# Altium schematic sheet Sheet1.SchDoc
size A4; Author: Christian Kieser; Engineer: Christian Kieser
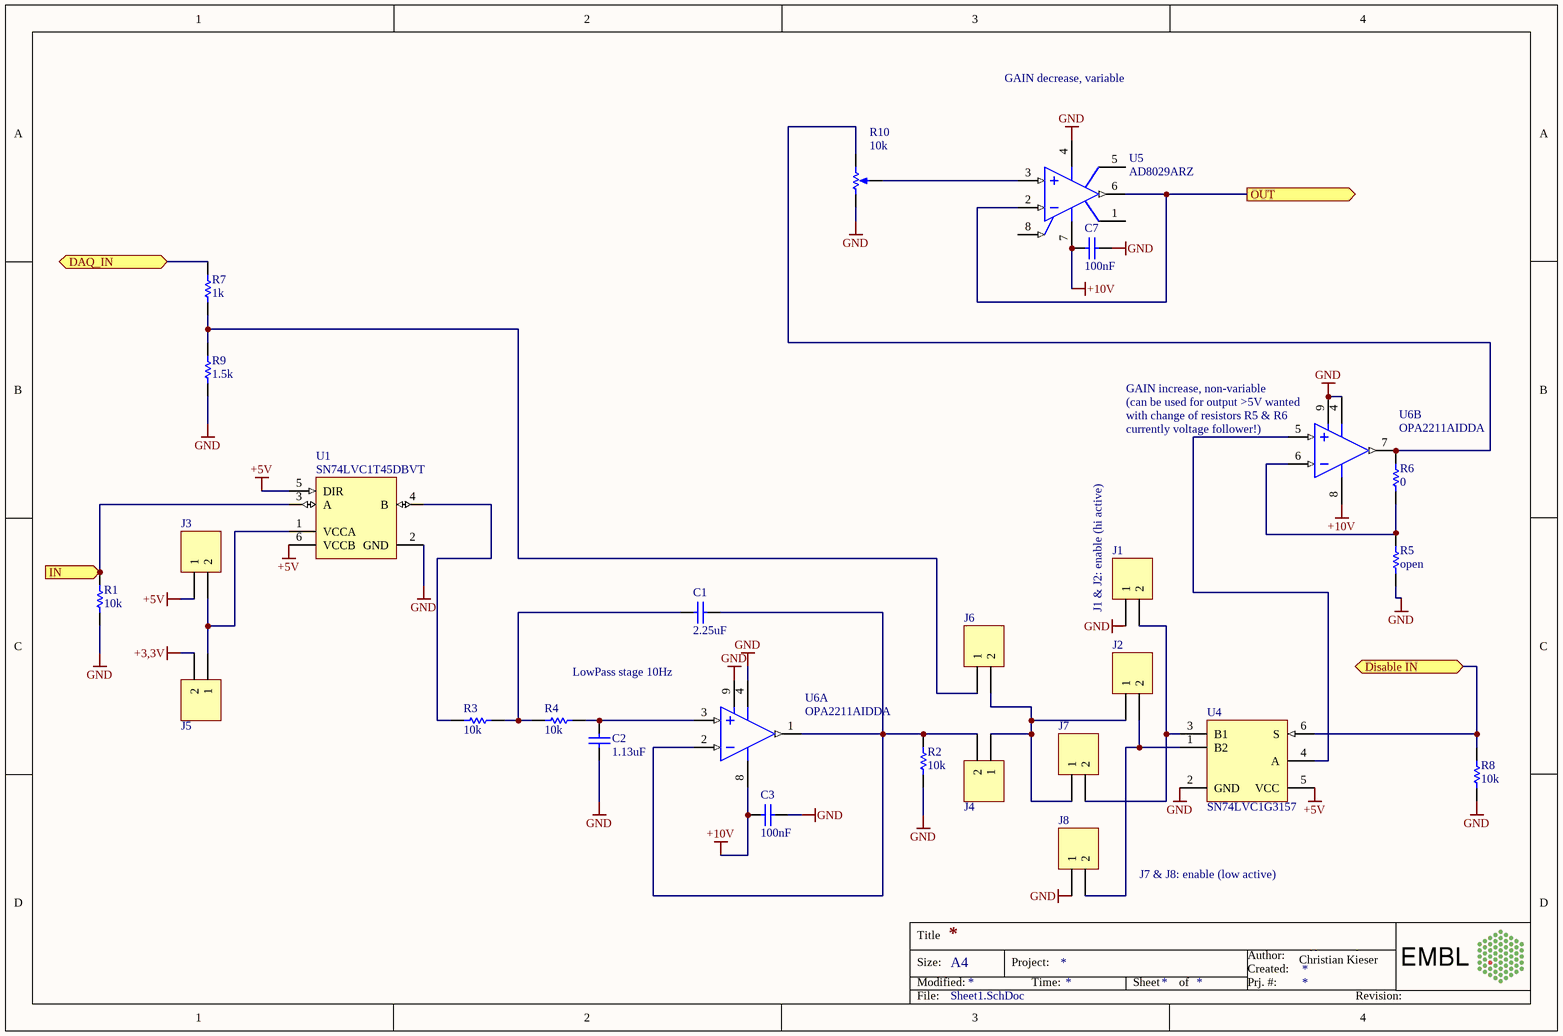
[diagram p0: Sheet1.SchDoc]

## Parts
C1  2.25uF  [CAPC1206(3216)190_N]
C2  1.13uF  [CAPC1206(3216)190_N]
C3  100nF  [CAPC2013X88X50ML20T25]
C7  100nF  [CAPC2013X88X50ML20T25]
J1  61300211121  [61300211121]  (value not drawn)
J2  61300211121  [61300211121]  (value not drawn)
J3  61300211121  [61300211121]  (value not drawn)
J4  61300211121  [61300211121]  (value not drawn)
J5  61300211121  [61300211121]  (value not drawn)
J6  61300211121  [61300211121]  (value not drawn)
J7  61300211121  [61300211121]  (value not drawn)
J8  61300211121  [61300211121]  (value not drawn)
R1  10k  [YAGO-RC0805_M]
R2  10k  [YAGO-RC0805_M]
R3  10k  [YAGO-RC0805_M]
R4  10k  [YAGO-RC0805_M]
R5  open  [YAGO-RC0805_M]
R6  0  [YAGO-RC0805_M]
R7  1k  [YAGO-RC0805_M]
R8  10k  [YAGO-RC0805_M]
R9  1.5k  [YAGO-RC0805_M]
R10  10k  [Typ 3362P]
U1  SN74LVC1T45DBVT  [DBV0006A_M]
U4  SN74LVC1G3157  [DBV0006A_N]
U5  AD8029ARZ  [ADI-R-8_L]
U6  OPA2211AIDDA  [DDA0008C_M]  (parts A,B of 2)

## Ports
DAQ_IN, Disable IN, IN (in), OUT (out)

## Nets
+3,3V: J5.2
+5V: J3.1 U1.5(DIR) U1.6(VCCB) U4.5(VCC)
+10V: C3.2 C7.2 U5.7(+VS) U6.8(V+)
GND: C2.1 C3.1 C7.1 J1.1 J8.1 R1.1 R2.1 R5.1 R8.2 R9.1 R10.1(CCW) U1.2(GND) U4.2(GND) U5.4(-VS) U6.4(V-) U6.9(EP)
DAQ_IN: R7.2 ; port DAQ_IN
Disable IN: R8.1 U4.6(S) ; port Disable IN
IN: R1.2 U1.3(A) ; port IN
OUT: U5.2(-IN) U5.6(VOUT) ; port OUT
NetC1_1: C1.1 R3.1 R4.2
NetC1_2: C1.2 J4.2 R2.2 U6.1(OUT_A) U6.2(IN_A-)
NetC2_2: C2.2 R4.1 U6.3(IN_A+)
NetJ1_2: J1.2 J7.2 U4.3(B1)
NetJ2_1: J2.1 J4.1 J6.2 J7.1
NetJ2_2: J2.2 J8.2 U4.1(B2)
NetJ3_2: J3.2 J5.1 U1.1(VCCA)
NetJ6_1: J6.1 R7.1 R9.2
NetR3_2: R3.2 U1.4(B)
NetR5_2: R5.2 R6.1 U6.6(IN_B-)
NetR6_2: R6.2 R10.3(CW) U6.7(OUT_B)
NetR10_2: R10.2(S) U5.3(+IN)
NetU4_4: U4.4(A) U6.5(IN_B+)

Not connected (* = marked no-connect by the designer): U5 1(NC) 5(NC) 8(~{DISABLE})

## Notes on the sheet
- GAIN decrease, variable
- (near U6) GAIN increase, non-variable
- (near U6) with change of resistors R5 & R6
- (near U6) (can be used for output >5V wanted
- (near U6) currently voltage follower!)
- (near J1) J1 & J2: enable (hi active)
- LowPass stage 10Hz
- J7 & J8: enable (low active)
- Christian Kieser
- Title
- Size:
- Modified:
- A4
- Project:
- Time:
- Sheet
- of
- Created:
- Author:
- Prj. #:
- Alfons Riedinger
- File:
- Revision:

## Library data of the parts
C1 C2 = CMP-001-0138-A.1: CAP CER 1UF 10V X7R 1206; Manufacturer: Wurth Electronics Inc.; Manufacturer Part Number: 885012208013; Notification: Current market demand for these product types have resulted in fluctuating and extending lead times. Lead times may differ.; Tolerance: ±10%; Applications: General Purpose; ComponentLink1Description: 885012208013.pdf; ComponentLink1URL: http://katalog.we-online.de/pbs/datasheet/885012208013.pdf; Features: -; Height - Seated (Max): -; Lead Spacing: -; Lead Style: -; Mounting Type: Surface Mount, MLCC; Operating Temperature: -55°C ~ 125°C; Package / Case: 1206 (3216 Metric); Packaging: Cut Tape (CT); Part Status: Active; Ratings: -; Size / Dimension: 0.126" L x 0.063" W (3.20mm x 1.60mm); Supplier: Digi-Key; Supplier Part Number: 732-7685-1-ND; Temperature Coefficient: X7R; Thickness (Max): 0.051" (1.30mm); Voltage - Rated: 10V
C3 C7 = CMP-001-0082-2: generic 0805 COG oder X7R Vielschichtkondensatoren max. +/-10%
J1-J8 = CMP-001-0071-1: 2Pol; gerade; WR-PHD 2.54 mm THT Pin Header; Brand: Wurth Electronics; Current Rating: 3 A; Insulation Resistance: 1 GOhms; Latching Type: Unlatched; Mating Post Length: 6 mm; Mounting Angle: Straight; Number of Positions: 2 Position; Pitch: 2.54 mm; Voltage Rating: 250 V; Accessory Type: -; Application: Wire to Board; ComponentLink1Description: 6130xx11121-538006.pdf; ComponentLink1URL: http://www.mouser.com/ds/2/445/6130xx11121-538006.pdf; Contact Gender: Pin (Male); Contact Material: Copper Alloy; Contact Plating: Gold; Contact Type: -; Flammability Rating: UL 94 V-0; Housing Gender: -; Housing Material: Polybutylene Terephthalate (PBT); Manufacturer: Wurth Electronics; Manufacturer Part Number: 61300211121; Minimum Order Quantity: 1; Mounting Style: Straight Pin; Number of Rows: 1 Row; Packaging: Bulk; Product: Headers; Reeling: False; RoHS - Mouser: Y; Row Spacing: -; Series: WR-PHD; Standard Pack Qty: 1000; Supplier: Mouser; Supplier Part Number: 710-61300211121; Termination Post Length: 3 mm; Termination Style: Through Hole; Type: Pin Strip; PartNumber: 61300211121
R1-R9 = CMP-001-0027-2: 0805 Yageo Standard BlackBox Resistors; Power (Watts): 0.125W, 1/8W; Temperature Coefficient: ±200ppm/°C; Tolerance: ±1%; ComponentLink1Description: PYu-RC_Group_51_RoHS_L_7.pdf; Part Status: Active; Size / Dimension: 0.079" L x 0.049" W (2.00mm x 1.25mm); Supplier Device Package: 0805; ComponentLink1URL: http://www.yageo.com/documents/recent/PYu-RC_Group_51_RoHS_L_7.pdf; Composition: Thick Film; Failure Rate: -; Features: Moisture Resistant; Height - Seated (Max): 0.024" (0.60mm); Manufacturer: Yageo; Operating Temperature: -55°C ~ 155°C; Package / Case: 0805 (2012 Metric); Packaging: Digi-Reel®
R10 = CMP-001-0077-3: Trimmer_stehend_quadratisch_Verstellung-von-oben; Manufacturer: Bourns Inc.; Manufacturer Part Number: 3362P-1-103LF; Adjustment Type: Top Adjustment; Number of Turns: 1; Power (Watts): 0.5W, 1/2W; Resistive Material: Cermet; Temperature Coefficient: ±100ppm/°C; Tolerance: ±10%; ComponentLink1Description: 3362.pdf; ComponentLink1URL: http://www.bourns.com/docs/Product-Datasheets/3362.pdf; Mounting Type: Through Hole; Packaging: Tube; Part Status: Active; Resistance (Ohms): 10k; Size / Dimension: Rectangular - 0.275" x 0.260" Face x 0.185" H (6.99mm x 6.60mm x 4.70mm); Supplier: Digi-Key; Supplier Part Number: 3362P-103LF-ND; Termination Style: PC Pins; PartNumber: 3362P-1-103LF
U1 = CMP-00492-1: Single-Bit Dual-Supply Bus Transceiver with Configurable Voltage Translation and 3-State Outputs, DBV0006A, SMALL T&R; Manufacturer: Texas Instruments; 3-State Output: Yes; VCC(Min)(V): 1.65; tpd @ Nom Voltage(Max)(ns): 15.5,8,5.8,4.4; Technology Family: LVC; Logic: True; Bits(#): 1; Rating: Catalog; Sub-Family: Dual Supply Translator; Schmitt Trigger: No; VCC(Max)(V): 5.5; Voltage(Nom)(V): 1.8,2.5,3.3,5; Output Drive (IOL/IOH)(Max)(mA): 32/-32; Input Type: CMOS/TTL; ICC @ Nom Voltage(Max)(mA): 0.004; Output Type: CMOS; F @ Nom Voltage(Max)(Mhz): 150; DatasheetVersion: SCES515K; Operating Temperature Range(C): -40 to 85; Generic Part Number: SN74LVC1T45; PackageReference: DBV0006A
U4 = CMP-001-0106-A.1: Analoger Schalter Single SPDT(Wechsler) SOT23-6; Manufacturer: Texas Instruments; Manufacturer Part Number: 74LVC1G3157DBVRE4; PartNumber: SN74LVC1G3157DBVR; -3db Bandwidth: 300MHz; Channel Capacitance (CS(off), CD(off)): 5.2pF; Channel-to-Channel Matching (&Delta;Ron): 100 mOhm; Charge Injection: 7pC; Crosstalk: -54dB @ 10MHz; Current - Leakage (IS(off)) (Max): 1µA; Multiplexer/Demultiplexer Circuit: 2:1; On-State Resistance (Max): 15 Ohm; Switch Time (Ton, Toff) (Max): 5.7ns, 3.8ns; Voltage - Supply, Single (V+): 1.65 V ~ 5.5 V; ComponentLink1Description: sn74lvc1g3157.pdf; ComponentLink1URL: http://www.ti.com/lit/ds/symlink/sn74lvc1g3157.pdf; Operating Temperature: -40°C ~ 85°C (TA); Package / Case: SOT-23-6; Packaging: Tape & Reel (TR); Part Status: Active; Supplier: Digi-Key; Supplier Device Package: SOT-23-6; Supplier Part Number: 74LVC1G3157DBVRE4-ND; Switch Circuit: SPDT; Voltage - Supply, Dual (V±): -
U5 = CMP-00480-1: Single Channel RRIO Operational Amplifier, 125 MHz BW, 62 V/us SR, Industrial, 8-pin SOIC (R-8), Tube; Manufacturer: Analog Devices; Generic Part Number: AD8029; Slew Rate: 62V/us; V Span Min: 2.7V; Input Bias Current: 700nA; Amplifiers Per Package: 1; Iq/Amp: 1.5mA; V Span Max: 12V; Input Offset Voltage: 1.6mV; Small Signal Bandwidth: 125MHz; PackageVersion: 060506-A; ComponentLink3URL: http://www.analog.com/static/imported-files/packages/PKG_PDF/SOIC_Narrow%20(R)/R_8.pdf; ComponentLink1Description: Manufacturer URL; ComponentLink1URL: http://www.analog.com/en/index.html; Code_JEDEC: MS-012-AA; ComponentLink2URL: http://www.analog.com/static/imported-files/data_sheets/AD8029_8030_8040.pdf; ComponentLink3Description: Package Specification; PackageDescription: 8-Pin Standard Small Outline Package, Body 3.9 x 4.9 mm, Pitch 1.27 mm; PartNumber: AD8029ARZ; Mounting Technology: Surface Mount; PackageReference: R-8; DatasheetVersion: Rev. B; ComponentLink2Description: Datasheet
U6 = CMP-00511-1: 1.1 nV/rtHz Noise, Low Power, Precision Operational Amplifier, 4.5 to 36 V, -40 to 125 degC, 8-pin SOP (DDA8), Green (RoHS & no Sb/Br); Manufacturer: Texas Instruments; CMRR(Min)(dB): 114; Vio (25C)(Max)(mV): 0.15; IIB(Max)(pA): 175000; GBW(Typ)(MHz): 45; Slew Rate(Typ)(V/us): 27; Packing: TUBE; Total Supply Voltage(Max)(+5V is 5, +/-5V is 10): 36; Total Supply Voltage(Min)(+5V is 5, +/-5V is 10): 4.5; Sub Family: High Supply Voltage Amplifier (>=30V), Low Noise Amp (<=10nV/rtHz), Low Offset Voltage Amplifier (<=500uV), Precision Amplifier; Offset Drift(Typ)(uV/C): 0.35; Number of Channels: 2; Rating: Catalog; Mounting Technology: Surface Mount; ComponentLink2URL: http://www.ti.com/lit/ds/symlink/opa2211a.pdf; PackageReference: DDA0008C; PartNumber: OPA2211AIDDA; ComponentLink1Description: Manufacturer URL; ComponentLink2Description: Datasheet; Code_JEDEC: MS-012; ComponentLink3Description: Package Specification; ComponentLink1URL: http://www.ti.com/; ComponentLink3URL: http://www.ti.com/litv/pdf/mpds092e; PackageVersion: 4202561/F, 12/2011; PackageDescription: 8-Pin PowerPAD(TM) Plastic Small Outline, Body 3.9 x 4.9 mm, Pitch 1.27 mm; Iq per channel(Max)(mA): 4.5; Eco-Plan: Green (RoHS & no Sb/Br); DatasheetVersion: SBOS377G